# Altium schematic sheet sch1.SchDoc
size 420 x 297 mm; Address1: Address1; Address2: Address2; Address3: Address3; Address4: Address4; DocumentNumber: АБВГ.123456.001 Э3; SheetNumber: 1; Scale: 1:1; DocumentType: Схема электрическая принципиальная; FirstReferrence: АБВГ.123456.001
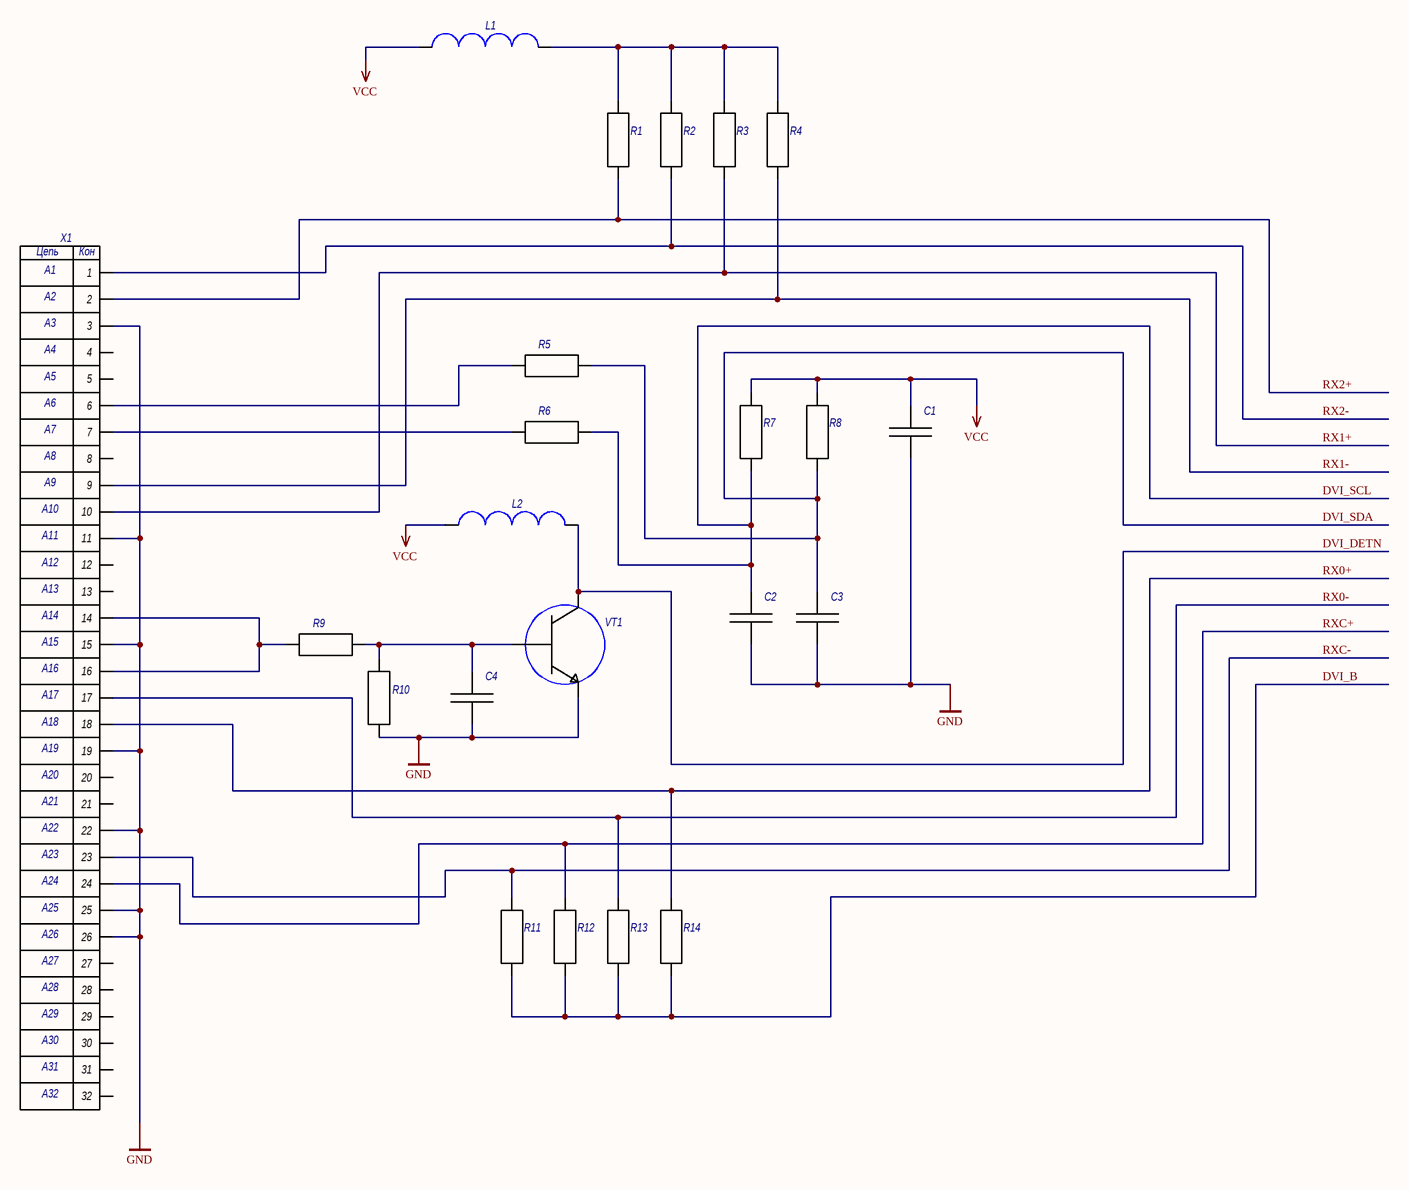
[diagram p0: sch1.SchDoc]

## Parts
C1  *  [Capacitor 0805]  (value not drawn)
C2  *  [Capacitor 0805]  (value not drawn)
C3  *  [Capacitor 0805]  (value not drawn)
C4  *  [Capacitor 0805]  (value not drawn)
L1  *  [Inductor 2520]  (value not drawn)
L2  *  [Inductor 2520]  (value not drawn)
R1  *  [Resistor 1206]  (value not drawn)
R2  *  [Resistor 1206]  (value not drawn)
R3  *  [Resistor 1206]  (value not drawn)
R4  *  [Resistor 1206]  (value not drawn)
R5  *  [Resistor 1206]  (value not drawn)
R6  *  [Resistor 1206]  (value not drawn)
R7  *  [Resistor 1206]  (value not drawn)
R8  *  [Resistor 1206]  (value not drawn)
R9  *  [Resistor 1206]  (value not drawn)
R10  *  [Resistor 1206]  (value not drawn)
R11  *  [Resistor 1206]  (value not drawn)
R12  *  [Resistor 1206]  (value not drawn)
R13  *  [Resistor 1206]  (value not drawn)
R14  *  [Resistor 1206]  (value not drawn)
VT1  *  [Transistor 1]  (value not drawn)
X1  *  [DVI Connector]  (value not drawn)

## Nets
GND: C1.1 C2.1 C3.1 C4.1 R10.1 VT1.1(KOLLECTOR) X1.3 X1.11 X1.15 X1.19 X1.22 X1.25 X1.26
VCC: C1.2 L1.1 L2.1 R7.2 R8.2
DVI_B: R11.1 R12.1 R13.1 R14.1
DVI_DETN: L2.2 VT1.2(EMITTER)
DVI_SCL: C2.2 R6.2 R7.1
DVI_SDA: C3.2 R5.2 R8.1
RX0+: R14.2 X1.18
RX0-: R13.2 X1.17
RX1+: R3.1 X1.10
RX1-: R4.1 X1.9
RX2+: R1.1 X1.2
RX2-: R2.1 X1.1
RXC+: R12.2 X1.24
RXC-: R11.2 X1.23
NetC4_2: C4.2 R9.2 R10.2 VT1.3(BAZA)
NetL1_2: L1.2 R1.2 R2.2 R3.2 R4.2
NetR5_1: R5.1 X1.6
NetR6_1: R6.1 X1.7
NetR9_1: R9.1 X1.14 X1.16

Not connected (* = marked no-connect by the designer): X1 4 5 8 12 13 20 21 27 28 29 30 31 32

## Notes on the sheet
- Перв. примен.
- Справ. №
- Подп. и дата
- Инв. № дубл.
- Взам. инв. №
- Разраб.
- Изм.
- Лист
- № докум.
- Подп.
- Дата
- Лит.
- Масса
- Масштаб
- Пров.
- Т.контр.
- Листов
- Инв. № подл.
- Утв.
- Н.контр.
- 2.106-A3
- Копировал
- Формат А3
- (in symbol DVI Connector) Цепь; Кон; A1; A2; A3; A4; A5; A6; A7; A8; A9; A10; A11; A12; A13; A14; A15; A16; A17; A18; A19; A20; A21; A22; A23; A24; A25; A26; A27; A28; A29; A30; A31; A32

## Library data of the parts
C1-C4 = Capacitor: Model: *
L1 L2 = Inductor: Model: *
R1-R14 = Resistor: Model: *
VT1 = Transistor 1
X1 = DVI Connector